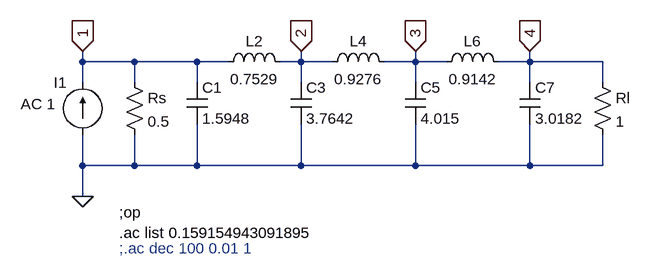
[diagram p0: schematic test_12_v1.asc]
test_12_v1.asc, the LTspice schematic file:
Version 4
SHEET 1 880 680
WIRE -400 -208 -400 -224
WIRE -320 -208 -400 -208
WIRE -224 -208 -320 -208
WIRE -176 -208 -224 -208
WIRE -64 -208 -64 -224
WIRE -64 -208 -96 -208
WIRE -16 -208 -64 -208
WIRE 112 -208 112 -224
WIRE 112 -208 64 -208
WIRE 160 -208 112 -208
WIRE 288 -208 288 -224
WIRE 288 -208 240 -208
WIRE 400 -208 288 -208
WIRE -400 -176 -400 -208
WIRE -320 -176 -320 -208
WIRE -224 -176 -224 -208
WIRE -64 -176 -64 -208
WIRE 112 -176 112 -208
WIRE 288 -176 288 -208
WIRE 400 -176 400 -208
WIRE -400 -48 -400 -96
WIRE -320 -48 -320 -96
WIRE -320 -48 -400 -48
WIRE -224 -48 -224 -112
WIRE -224 -48 -320 -48
WIRE -64 -48 -64 -112
WIRE -64 -48 -224 -48
WIRE 112 -48 112 -112
WIRE 112 -48 -64 -48
WIRE 288 -48 288 -112
WIRE 288 -48 112 -48
WIRE 400 -48 400 -96
WIRE 400 -48 288 -48
WIRE -400 0 -400 -48
FLAG -400 0 0
FLAG -400 -224 1
IOPIN -400 -224 In
FLAG -64 -224 2
IOPIN -64 -224 In
FLAG 112 -224 3
IOPIN 112 -224 In
FLAG 288 -224 4
IOPIN 288 -224 In
SYMBOL cap -80 -176 R0
SYMATTR InstName C3
SYMATTR Value 3.7642
SYMBOL current -400 -96 R180
WINDOW 0 24 80 Left 2
WINDOW 3 24 0 Left 2
WINDOW 123 42 47 Left 2
WINDOW 39 0 0 Left 0
SYMATTR InstName I1
SYMATTR Value ""
SYMATTR Value2 AC 1
SYMBOL cap 96 -176 R0
SYMATTR InstName C5
SYMATTR Value 4.015
SYMBOL cap 272 -176 R0
SYMATTR InstName C7
SYMATTR Value 3.0182
SYMATTR SpiceLine Rser=0
SYMBOL ind -192 -192 R270
WINDOW 0 32 56 VTop 2
WINDOW 3 5 56 VBottom 2
SYMATTR InstName L2
SYMATTR Value 0.7529
SYMATTR SpiceLine Rser=0
SYMBOL ind -32 -192 R270
WINDOW 0 32 56 VTop 2
WINDOW 3 5 56 VBottom 2
SYMATTR InstName L4
SYMATTR Value 0.9276
SYMATTR SpiceLine Rser=0
SYMBOL ind 144 -192 R270
WINDOW 0 32 56 VTop 2
WINDOW 3 5 56 VBottom 2
SYMATTR InstName L6
SYMATTR Value 0.9142
SYMATTR SpiceLine Rser=0
SYMBOL res -336 -192 R0
SYMATTR InstName Rs
SYMATTR Value 0.5
SYMBOL res 384 -192 R0
SYMATTR InstName Rl
SYMATTR Value 1
SYMBOL cap -240 -176 R0
SYMATTR InstName C1
SYMATTR Value 1.5948
TEXT -344 24 Left 2 !;op
TEXT -344 56 Left 2 !.ac list 0.159154943091895
TEXT -344 80 Left 2 ;;.ac dec 100 0.01 1

The netlist it stands for:
* test_12_v1.asc
C3 2 0 3.7642
I1 0 1 AC 1
C5 3 0 4.015
C7 4 0 3.0182 Rser=0
L2 1 2 0.7529 Rser=0
L4 2 3 0.9276 Rser=0
L6 3 4 0.9142 Rser=0
Rs 1 0 0.5
Rl 4 0 1
C1 1 0 1.5948
;op
.ac list 0.159154943091895
* ;.ac dec 100 0.01 1
.backanno
.end